# EAGLE design 主機v0.2 (EAGLE 6.3)
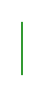
[diagram p0: schematic, sheet 1, part 1 of 2]
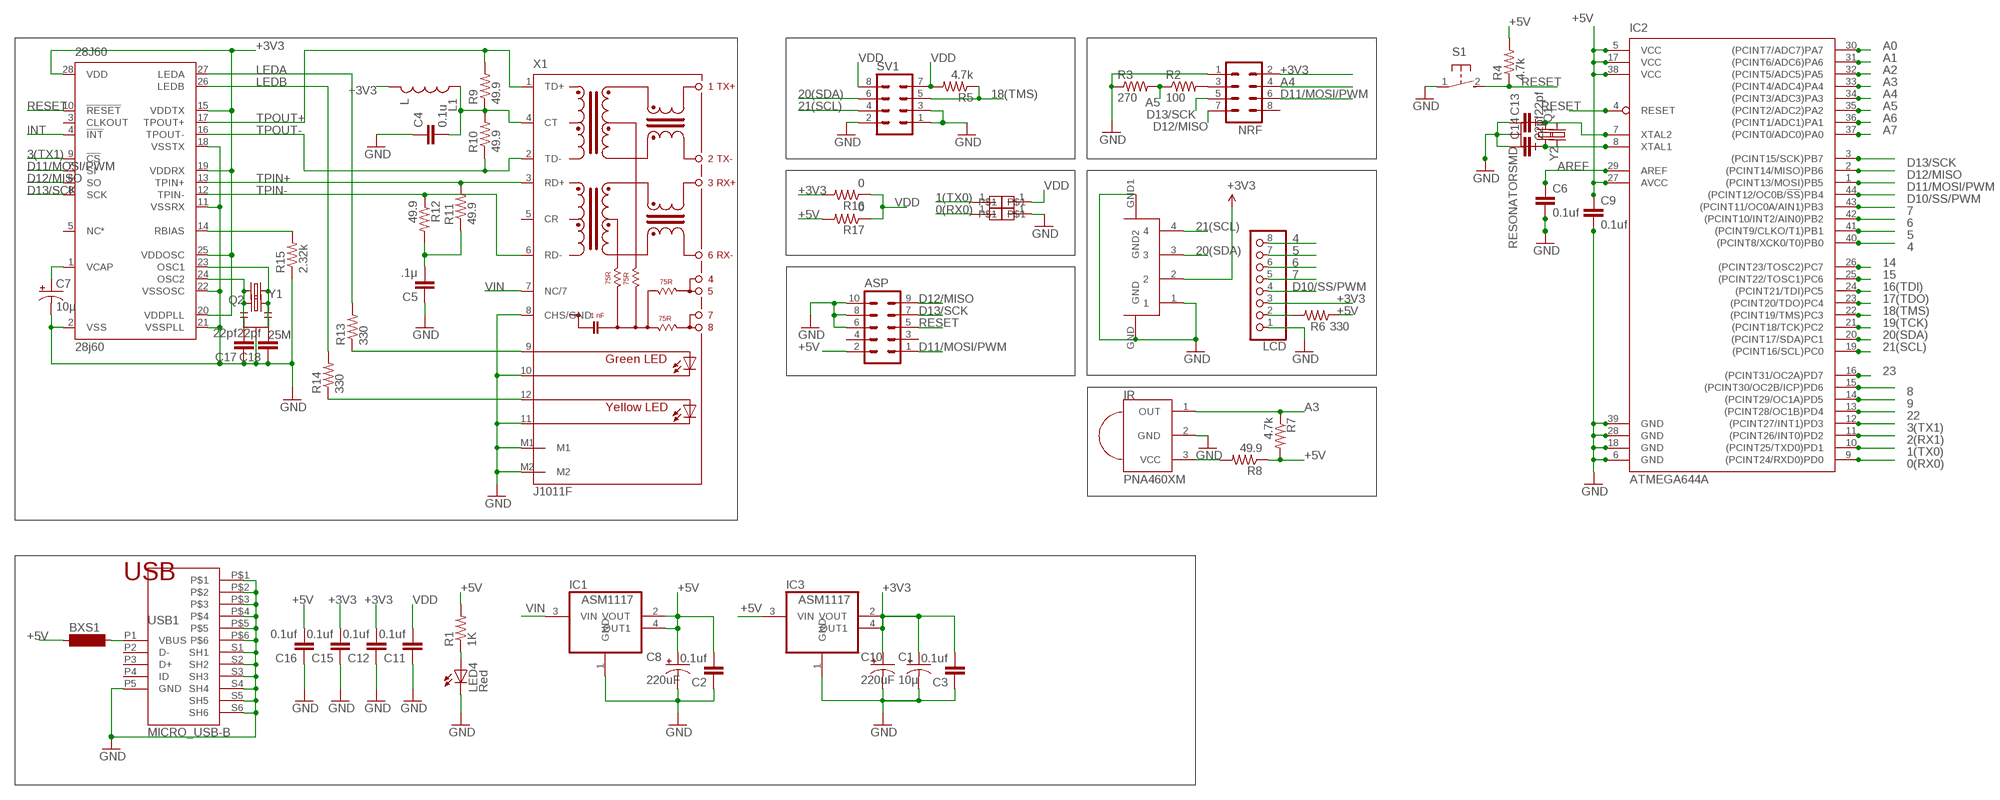
[diagram p1: schematic, sheet 1, part 2 of 2]

## Parts
28J60  28j60  ENC28J60/SS  [SSOP28DB]
ASP  MA05-2  [MA05-2]
BXS1  SM-1206  [SM-1206]
C1  10μ  CAP_POL3528  [EIA3528]
C2  0.1uf  CAP0603-CAP  [0603-CAP]
C3  0.1uf  CAP0603-CAP  [0603-CAP]
C4  0.1u  CAP0603-CAP  [0603-CAP]
C5  .1μ  CAP0603-CAP  [0603-CAP]
C6  0.1uf  CAP0603-CAP  [0603-CAP]
C7  10μ  CAP_POL3528  [EIA3528]
C8  220uF  CPOL-US153CLV-0605  [153CLV-0605]
C9  0.1uf  CAP0603-CAP  [0603-CAP]
C10  220uF  CPOL-US153CLV-0605  [153CLV-0605]
C11  0.1uf  CAP0603-CAP  [0603-CAP]
C12  0.1uf  CAP0603-CAP  [0603-CAP]
C13  22pf  CAP0603-CAP  [0603-CAP]
C14  22pf  CAP0603-CAP  [0603-CAP]
C15  0.1uf  CAP0603-CAP  [0603-CAP]
C16  0.1uf  CAP0603-CAP  [0603-CAP]
C17  22pf  CAP0603-CAP  [0603-CAP]
C18  22pf  CAP0603-CAP  [0603-CAP]
IC1  ASM1117  [SOT223]
IC2  ATMEGA644A  [TQFP44]
IC3  ASM1117  [SOT223]
IR  PNA460XM  [PNA460XM]
L1  L  INDUCTOR0603  [0603]
LCD  PINHD-1X8  [1X08]
LED4  Red  LED0805  [0805-LED]
NRF  MA04-2  [MA04-2]
Q1  CRYSTALHC49S  [HC49/S]
Q2  CRYSTALHC49S  [HC49/S]
R1  1K  RESISTOR0603-RES  [0603-RES]
R2  100  RESISTOR0603-RES  [0603-RES]
R3  270  RESISTOR0603-RES  [0603-RES]
R4  4.7k  RESISTOR0603-RES  [0603-RES]
R5  4.7k  RESISTOR0603-RES  [0603-RES]
R6  330  RESISTOR0603-RES  [0603-RES]
R7  4.7k  RESISTOR0603-RES  [0603-RES]
R8  49.9  RESISTOR0603-RES  [0603-RES]
R9  49.9  RESISTOR0603-RES  [0603-RES]
R10  49.9  RESISTOR0603-RES  [0603-RES]
R11  49.9  RESISTOR0603-RES  [0603-RES]
R12  49.9  RESISTOR0603-RES  [0603-RES]
R13  330  RESISTOR0603-RES  [0603-RES]
R14  330  RESISTOR0603-RES  [0603-RES]
R15  2.32k  RESISTOR0603-RES  [0603-RES]
R16  0  RESISTOR0603-RES  [0603-RES]
R17  0  RESISTOR0603-RES  [0603-RES]
S1  31-XX  [B3F-31XX]
SV1  MA04-2  [MA04-2]
U$2  S4B-XH-SM4-TB  [XH-SM4-TB]
U$4  PIN1  [PIN1]
U$5  PIN1  [PIN1]
U$6  PIN1  [PIN1]
U$7  PIN1  [PIN1]
USB1  MICRO_USB-B  [USB_MICRO_B]
X1  J1011F  RJ45-HR911105A  [HRJ]
Y1  25M  RESONATORSMD  [RESONATOR-SMD]
Y2  RESONATORSMD  [RESONATOR-SMD]

## Nets
0(RX0): IC2.9((PCINT24/RXD0)PD0) U$7.1
1(TX0): IC2.10((PCINT25/TXD0)PD1) U$6.1
2(RX1): IC2.11((PCINT26/INT0)PD2)
3(TX1): 28J60.9(!CS) IC2.12((PCINT27/INT1)PD3)
4: IC2.40((PCINT8/XCK0/T0)PB0) LCD.8
5: IC2.41((PCINT9/CLKO/T1)PB1) LCD.7
6: IC2.42((PCINT10/INT2/AIN0)PB2) LCD.6
7: IC2.43((PCINT11/OC0A/AIN1)PB3) LCD.5
8: IC2.15((PCINT30/OC2B/ICP)PD6)
9: IC2.14((PCINT29/OC1A)PD5)
14: IC2.26((PCINT23/TOSC2)PC7)
15: IC2.25((PCINT22/TOSC1)PC6)
16(TDI): IC2.24((PCINT21/TDI)PC5)
17(TDO): IC2.23((PCINT20/TDO)PC4)
18(TMS): IC2.22((PCINT19/TMS)PC3) R5.1 SV1.5
19(TCK): IC2.21((PCINT18/TCK)PC2)
20(SDA): IC2.20((PCINT17/SDA)PC1) SV1.6 U$2.3
21(SCL): IC2.19((PCINT16/SCL)PC0) SV1.4 U$2.4
22: IC2.13((PCINT28/OC1B)PD4)
23: IC2.16((PCINT31/OC2A)PD7)
+3V3: 28J60.15(VDDTX) 28J60.19(VDDRX) 28J60.20(VDDPLL) 28J60.25(VDDOSC) 28J60.28(VDD) C1.A(+) C3.2 C10.+ C12.2 C15.2 IC3.2(VOUT) IC3.4(OUT1) L1.2 LCD.3 NRF.2 R16.2 U$2.2
+5V: ASP.2 BXS1.1 C2.2 C8.+ C9.1 C16.2 IC1.2(VOUT) IC1.4(OUT1) IC2.5(VCC) IC2.17(VCC) IC2.27(AVCC) IC2.38(VCC) IC3.3(VIN) R1.2 R4.2 R6.1 R7.2 R8.1 R17.2
A0: IC2.30((PCINT7/ADC7)PA7)
A1: IC2.31((PCINT6/ADC6)PA6)
A2: IC2.32((PCINT5/ADC5)PA5)
A3: IC2.33((PCINT4/ADC4)PA4) IR.1(OUT) R7.1
A4: IC2.34((PCINT3/ADC3)PA3) NRF.4
A5: IC2.35((PCINT2/ADC2)PA2) R2.1 R3.2
A6: IC2.36((PCINT1/ADC1)PA1)
A7: IC2.37((PCINT0/ADC0)PA0)
AREF: C6.1 IC2.29(AREF)
D10/SS/PWM: IC2.44((PCINT12/OC0B/!SS!)PB4) LCD.4
D11/MOSI/PWM: 28J60.7(SI) ASP.1 IC2.1((PCINT13/MOSI)PB5) NRF.6
D12/MISO: 28J60.6(SO) ASP.9 IC2.2((PCINT14/MISO)PB6) NRF.7
D13/SCK: 28J60.8(SCK) ASP.7 IC2.3((PCINT15/SCK)PB7) NRF.5
GND [power]: 28J60.2(VSS) 28J60.11(VSSRX) 28J60.18(VSSTX) 28J60.21(VSSPLL) 28J60.22(VSSOSC) ASP.6 ASP.8 ASP.10 C1.C(-) C2.1 C3.1 C4.1 C5.1 C6.2 C7.C(-) C8.- C9.2 C10.- C11.1 C12.1 C13.1 C14.1 C15.1 C16.1 C17.1 C18.1 IC1.1(GND) IC2.6(GND) IC2.18(GND) IC2.28(GND) IC2.39(GND) IC3.1(GND) IR.2(GND) LCD.1 LED4.C NRF.1 R3.1 R15.1 S1.1(P) SV1.1 SV1.2 SV1.3 U$2.1 U$2.GND U$2.GND1(GND2) U$4.1 USB1.P5(GND) USB1.P$1 USB1.P$2 USB1.P$3 USB1.P$4 USB1.P$5 USB1.P$6 USB1.S1(SH1) USB1.S2(SH2) USB1.S3(SH3) USB1.S4(SH4) USB1.S5(SH5) USB1.S6(SH6) X1.8(CHS/GND) X1.10(C-R) X1.11(C-L) X1.M1 X1.M2 Y1.2 Y2.2
INT: 28J60.4(!INT)
LEDA: 28J60.27(LEDA) R13.2
LEDB: 28J60.26(LEDB) R14.2
N$1: C13.2 IC2.7(XTAL2) Q1.2 Y2.1
N$3: IR.3(VCC) R8.2
N$5: LED4.A R1.1
N$7: NRF.3 R2.2
N$9: C5.2 R11.1 R12.2
N$11: 28J60.1(VCAP) C7.A(+)
N$13: 28J60.14(RBIAS) R15.2
N$14: C14.2 IC2.8(XTAL1) Q1.1 Y2.3
N$15: C4.2 L1.1 R9.1 R10.2 X1.4(CT)
N$16: 28J60.24(OSC2) C17.2 Q2.2 Y1.1
N$17: 28J60.23(OSC1) C18.2 Q2.1 Y1.3
N$23: R13.1 X1.9(A-R)
N$24: R14.1 X1.12(AL)
N$29: LCD.2 R6.2
RESET: 28J60.10(!RESET) ASP.5 IC2.4(RESET) R4.1 S1.2(S)
TPIN+: 28J60.13(TPIN+) R11.2 X1.3(RD+)
TPIN-: 28J60.12(TPIN-) R12.1 X1.6(RD-)
TPOUT+: 28J60.17(TPOUT+) R9.2 X1.1(TD+)
TPOUT-: 28J60.16(TPOUT-) R10.1 X1.2(TD-)
VDD: C11.2 R5.2 R16.1 R17.1 SV1.7 SV1.8 U$5.1
VIN: IC1.3(VIN) X1.7(NC/7)
VUSB: BXS1.2 USB1.P1(VBUS)
Unconnected: 28J60.3(CLKOUT) 28J60.5(NC*) ASP.3 ASP.4 NRF.8 USB1.P2(D-) USB1.P3(D+) USB1.P4(ID) X1.5(CR)

## Notes on the sheet
- USB

## Library data of the parts
28J60 = MY3:ENC28J60: Stand-Alone Ethernet Controller with SPI Interface Source: http://ww1.microchip.com/downloads/en/DeviceDoc/39662c.pdf
ASP = pkj:MA05-2: PIN HEADER; OC_FARNELL: unknown; OC_NEWARK: unknown
BXS1 = inductor-neosid:SM-1206: INDUCTOR SMD chip inductor; OC_FARNELL: unknown; OC_NEWARK: unknown
C1 C7 = 00my:CAP_POL: Capacitor Polarized These are standard SMD and PTH capacitors. Normally 10uF, 47uF, and 100uF in electrolytic and tantalum varieties. Always verify the external diameter of the through hole cap, it varies with capacity, voltage, and manufacturer. The EIA devices should be standard.
C2 C3 C11 C12 C15 C16 = MY:CAP: Capacitor Standard 0603 ceramic capacitor, and 0.1" leaded capacitor.
C4-C6 C9 C13 C14 C17 C18 = 00my:CAP: Capacitor Standard 0603 ceramic capacitor, and 0.1" leaded capacitor.
C8 C10 = resistor:CPOL-US: POLARIZED CAPACITOR, American symbol
IC1 IC3 = MY3:ASM1117: 800mA and 1A Low Dropout (LDO) Positive Regulator 1.8V, 2.5V, 2.85V, 3.3V, 5V, and Adj; MPN: REG1117; OC_FARNELL: 1097566; OC_NEWARK: 14P6981
IC2 = 00my:ATMEGA644: 8-bit Microcontroller with 64K Bytes In-System Programmable Flash Source: http://www.atmel.com/dyn/resources/prod_documents/doc2593.pdf; MPN: ATMEGA644PV-10AU; OC_FARNELL: 1455123; OC_NEWARK: 58M3748
IR = adafruit:PNA460XM: IR 38KHz receiver PNA4602 and related receivers http://www.ladyada.net/library/pcb/eaglelibrary.html
L1 = 00my:INDUCTOR: Inductors Basic Inductor/Choke - 0603 and 1206. Footprints are not proven and vary greatly between part numbers.
LCD = pinhead:PINHD-1X8: PIN HEADER
LED4 = MY:LED: LEDs Standard schematic elements and footprints for 5mm, 3mm, 1206, and 0603 sized LEDs. 5mm - Spark Fun Electronics SKU : COM-00529 (and others)
NRF SV1 = pkj:MA04-2: PIN HEADER; OC_FARNELL: unknown; OC_NEWARK: unknown
Q1 Q2 = crystal:CRYSTAL: CRYSTAL; OC_FARNELL: 1667008; OC_NEWARK: unknown
R1-R3 R5-R8 R16 R17 = MY:RESISTOR: Resistor Basic schematic elements and footprints for 0603, 1206, and PTH 1/10th watt (small) resistors.
R4 R9-R15 = 00my:RESISTOR: Resistor Basic schematic elements and footprints for 0603, 1206, and PTH 1/10th watt (small) resistors.
S1 = switch-omron:31-XX: OMRON SWITCH; MPN: B3F-3100; OC_FARNELL: 959704; OC_NEWARK: 36M3582
U$2 = microduino:S4B-XH
U$4-U$7 = pkj:PIN1
USB1 = 00my:MICRO_USB
X1 = 00my:RJ45: PULSEJACK (TM) 1x1 Tab-UP RJ45 10/100 Base-TX RJ45 1x1 Tab-UP with LEDs 8-pin (J1 series) and 6-pin (JP series) integrated magnetics connector, designed to support applications, such as ADSL modems, LAN-on-Motherboard, and Hub and Switches. Source: www.pulseeng.com .. PulseJack-J402.pdf
Y1 = 00my:RESONATOR: Resonator Small SMD resonator. This is the itty bitty 10/20MHz resonators with built in caps. CSTCE10M0G55 and CSTCE20M0V53. Footprint has been reviewed closely but hasn't been tested yet.
Y2 = MY:RESONATOR: Resonator Small SMD resonator. This is the itty bitty 10/20MHz resonators with built in caps. CSTCE10M0G55 and CSTCE20M0V53. Footprint has been reviewed closely but hasn't been tested yet.

## Net classes
1 power: width 0.381 mm

## Board
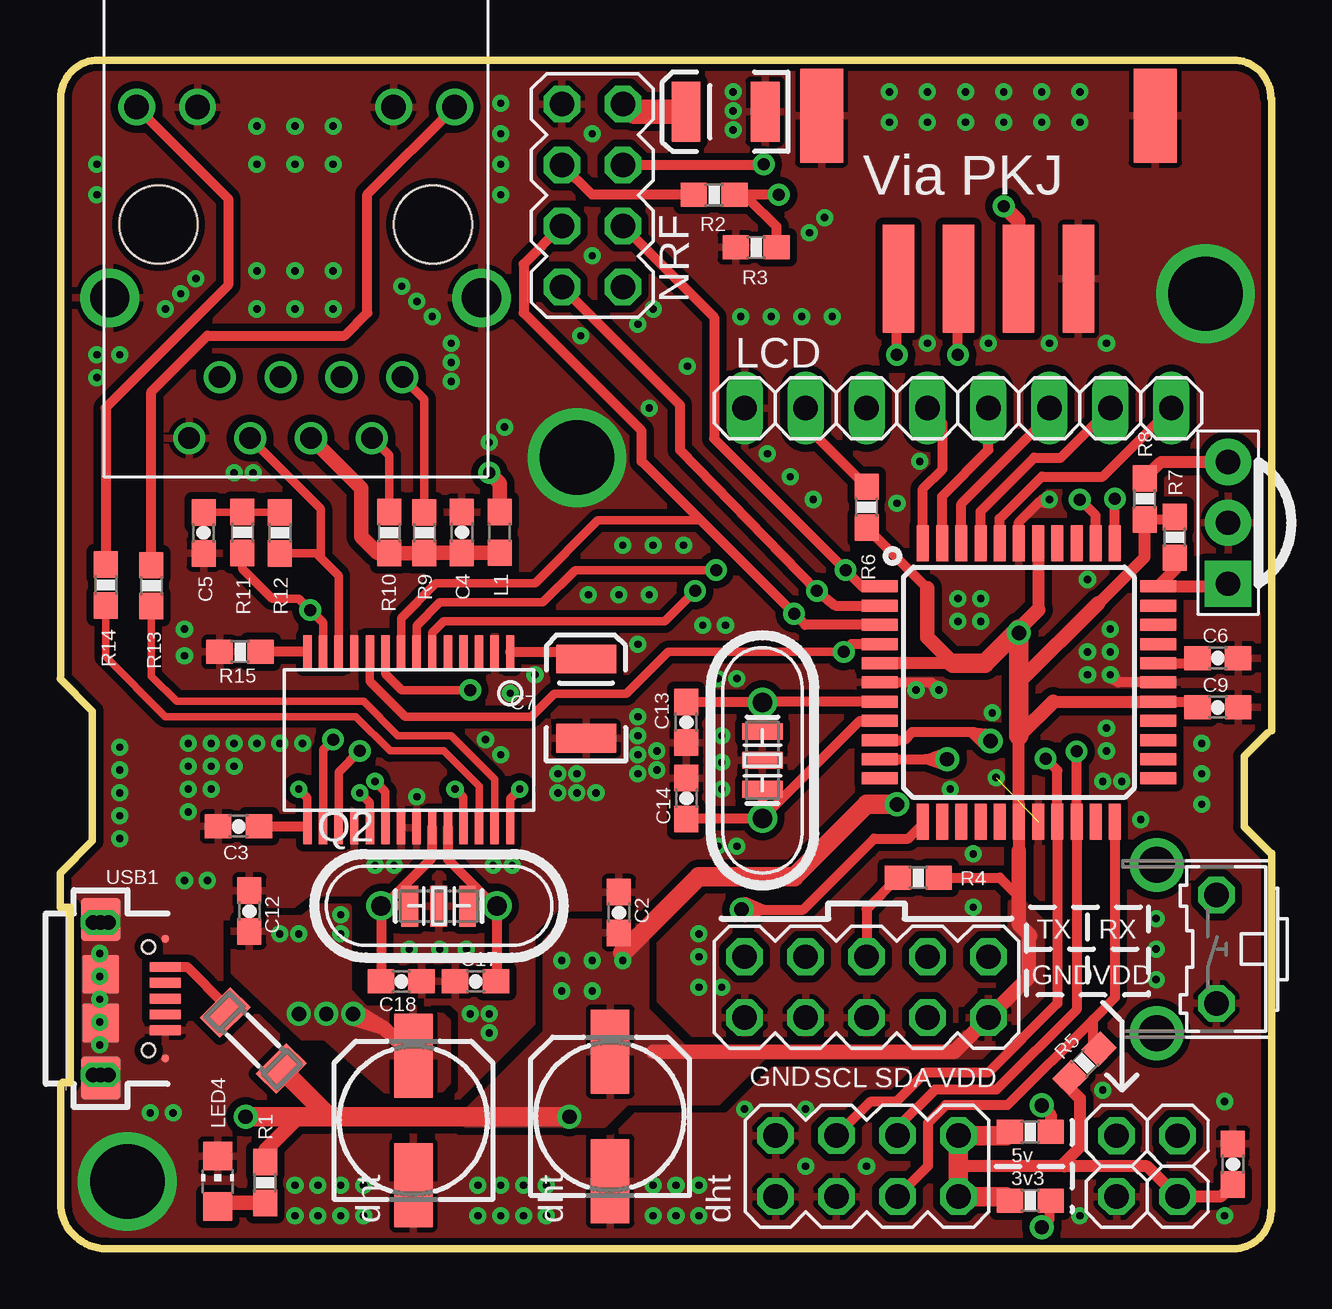
[diagram p2: board, top side]
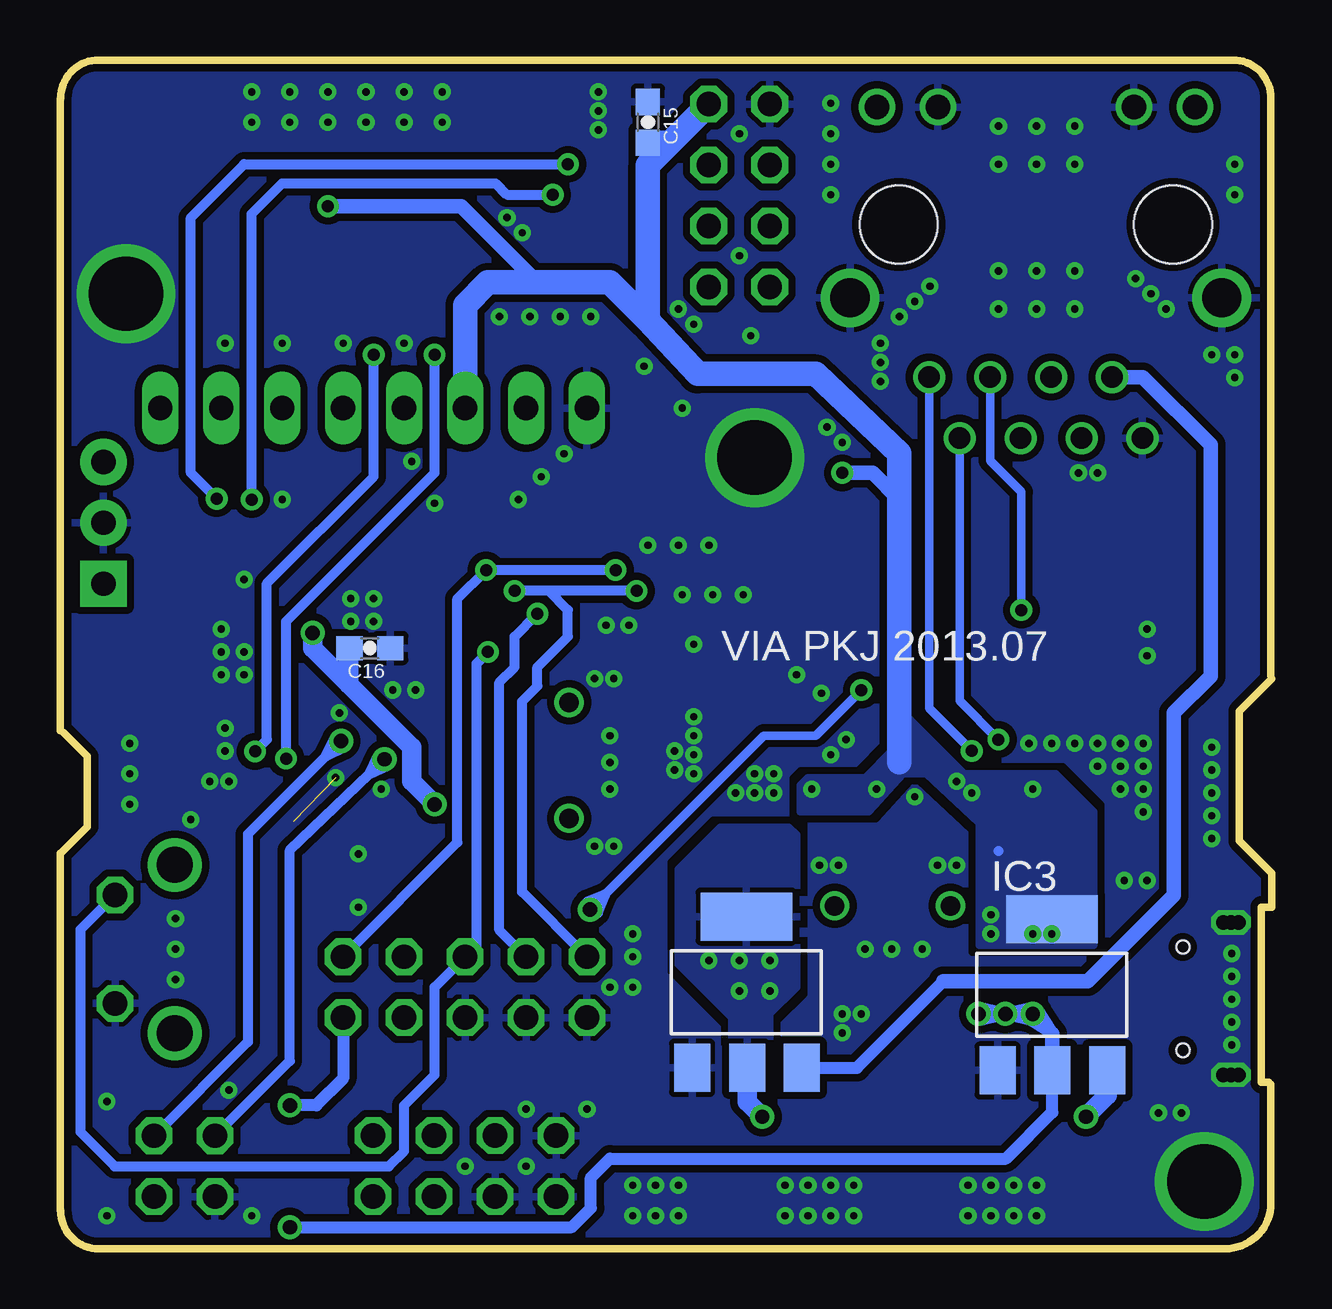
[diagram p3: board, bottom side, seen from below]

Size 50.48 x 49.53 mm. Coordinates in mm from the lower left corner, seen from the top.
Outline: 50.46,1.59 arc-90 48.87,0 1.93,0 arc-90 0.03,1.91 0.03,6.85
Outline: 50.46,47.94 arc90 48.87,49.53 1.61,49.53 arc90 0.03,47.94
Outline: 0.03,47.83 0.03,23.88
Outline: 0,23.75 1.35,22.4 1.35,16.99 0,15.65 0,14.23 0.43,14.23 0.43,6.93 0.11,6.93
Outline: 50.32,21.49 49.34,20.51 49.34,17.59 50.44,16.49
Outline: 50.48,16.49 50.48,1.58
Outline: 50.48,47.92 50.48,21.58
Copper layers (1*16): Top 0.035mm / dielectric 1.5mm / Bottom 0.035mm
Design rules "pkj2 *": minimum track width 8mil, minimum drill 2mil, track to track 8mil, track to pad 8mil, pad to pad 8mil, via to via 8mil, smd to smd 0mil, copper to edge 8mil, drill to drill 8mil, minimum pad ring 8mil, minimum via ring 8mil, stop-mask expansion 2mil, vias tented up to drill 25mil, thermal gap 8mil

### Footprints (pad centres in the part's own frame; a part is rotated, then mirrored left to right if it is on the bottom)
SSOP28DB = smd 0.348 x 1.397: 1 -4.225,-3.656; 2 -3.575,-3.656; 3 -2.925,-3.656; 4 -2.275,-3.656; 5 -1.625,-3.656; 6 -0.975,-3.656; 7 -0.325,-3.656; 8 0.325,-3.656; 9 0.975,-3.656; 10 1.625,-3.656; 11 2.275,-3.656; 12 2.925,-3.656; 13 3.575,-3.656; 14 4.225,-3.656; 15 4.225,3.656; 16 3.575,3.656; 17 2.925,3.656; 18 2.275,3.656; 19 1.625,3.656; 20 0.975,3.656; 21 0.325,3.656; 22 -0.325,3.656; 23 -0.975,3.656; 24 -1.625,3.656; 25 -2.275,3.656; 26 -2.925,3.656; 27 -3.575,3.656; 28 -4.225,3.656
MA05-2 = drill 1.016 octagon: 1 -5.08,-1.27; 2 -5.08,1.27; 3 -2.54,-1.27; 4 -2.54,1.27; 5 0,-1.27; 6 0,1.27; 7 2.54,-1.27; 8 2.54,1.27; 9 5.08,-1.27; 10 5.08,1.27
SM-1206 = smd 1.2 x 1.8: 1 -1.65,0; 2 1.65,0
EIA3528 = smd 1.2 x 2.5: A 1.65,0; C -1.65,0
0603-CAP = smd 1.1 x 1: 1 -0.85,0; 2 0.85,0
153CLV-0605 = smd 3.5 x 1.6: + 2.7,0; - -2.7,0
SOT223 = smd 1.499 x 2.007: 1 -2.261,-3.15; 2 0.025,-3.15; 3 2.311,-3.15 | smd 3.81 x 2.007: 4 0,3.15
TQFP44 = smd 1.5 x 0.5: 1 -5.8,4; 2 -5.8,3.2; 3 -5.8,2.4; 4 -5.8,1.6; 5 -5.8,0.8; 6 -5.8,0; 7 -5.8,-0.8; 8 -5.8,-1.6; 9 -5.8,-2.4; 10 -5.8,-3.2; 11 -5.8,-4; 23 5.8,-4; 24 5.8,-3.2; 25 5.8,-2.4; 26 5.8,-1.6; 27 5.8,-0.8; 28 5.8,0; 29 5.8,0.8; 30 5.8,1.6; 31 5.8,2.4; 32 5.8,3.2; 33 5.8,4 | smd 0.5 x 1.5: 12 -4,-5.8; 13 -3.2,-5.8; 14 -2.4,-5.8; 15 -1.6,-5.8; 16 -0.8,-5.8; 17 0,-5.8; 18 0.8,-5.8; 19 1.6,-5.8; 20 2.4,-5.8; 21 3.2,-5.8; 22 4,-5.8; 34 4,5.8; 35 3.2,5.8; 36 2.4,5.8; 37 1.6,5.8; 38 0.8,5.8; 39 0,5.8; 40 -0.8,5.8; 41 -1.6,5.8; 42 -2.4,5.8; 43 -3.2,5.8; 44 -4,5.8
PNA460XM = drill 1.016 pad 1.93 square: 1 -2.54,0 | drill 1.016 pad 1.93: 2 0,0; 3 2.54,0
0603 = smd 1.1 x 1: 1 -0.85,0; 2 0.85,0
1X08 = drill 1.016 long: 1 -8.89,0; 2 -6.35,0; 3 -3.81,0; 4 -1.27,0; 5 1.27,0; 6 3.81,0; 7 6.35,0; 8 8.89,0
0805-LED = smd 1.2 x 1.2: A 0,-1.05; C 0,1.05
MA04-2 = drill 1.016 octagon: 1 -3.81,-1.27; 2 -3.81,1.27; 3 -1.27,-1.27; 4 -1.27,1.27; 5 1.27,-1.27; 6 1.27,1.27; 7 3.81,-1.27; 8 3.81,1.27
HC49/S = drill 0.813: 1 -2.413,0; 2 2.413,0
0603-RES = smd 1.1 x 1: 1 -0.85,0; 2 0.85,0
B3F-31XX = drill 1.016 octagon: 1 -2.261,-1.245; 2 2.261,-1.245 | drill 1.499 pad 2.159: 3 -3.505,1.245; 4 3.505,1.245
XH-SM4-TB = smd 1.3 x 4.5: 1 -3.75,8.75; 2 -1.25,8.75; 3 1.25,8.75; 4 3.75,8.75 | smd 1.8 x 3.9: GND -6.95,1.95; GND1 6.95,1.95
PIN1 = drill 1.016 octagon: 1 0,0
USB_MICRO_B = smd 0.406 x 1.346: P1 -1.321,2.692; P2 -0.66,2.692; P3 0,2.692; P4 0.66,2.692; P5 1.321,2.692 | drill 0.6 octagon: P$1 -3.175,0.318; P$2 -3.175,0; P$3 -3.175,-0.318; P$4 3.175,0.318; P$5 3.175,0; P$6 3.175,-0.318 | smd 1.778 x 1.651: S1 -3.302,0; S2 3.302,0 | smd 0.305 x 0.305: S3 -2.489,2.692; S4 2.489,2.692 | smd 1.626 x 1.524: S5 -1.016,0; S6 1.016,0 | hole 0.55: -2.15,2; 2.15,2
HRJ = drill 0.89: 1 4.45,-6.35; 2 3.18,-8.89; 3 1.91,-6.35; 4 0.64,-8.89; 5 -0.63,-6.35; 6 -1.9,-8.89; 7 -3.17,-6.35; 8 -4.44,-8.89 | drill 1.02: 9 6.625,4.9; 10 4.085,4.9; 11 -4.085,4.9; 12 -6.625,4.9 | drill 1.63: M1 -7.745,-3.05; M2 7.745,-3.05 | hole 3.25: -5.715,0; 5.715,0
RESONATOR-SMD = smd 0.7 x 1.7: 1 -1.2,0; 2 0,0; 3 1.2,0

### Placement (x,y rotation side)
28J60  14.53,21.2 180 top
ASP  33.6,10.9 180 top
BXS1  8.05,8.67 135 top
C1  27.73,47.38 180 top
C2  23.29,14.01 270 top
C3  7.44,17.6 0 top
C4  16.75,29.84 270 top
C5  5.98,29.82 90 top
C6  48.24,24.61 0 top
C7  21.92,22.92 90 top
C8  22.92,5.52 90 top
C9  48.24,22.56 0 top
C10  14.73,5.35 90 top
C11  48.87,3.52 270 top
C12  7.89,14.07 270 top
C13  26.1,21.94 90 top
C14  26.1,18.76 270 top
C15  25.98,46.93 270 bottom
C16  37.57,25.03 180 bottom
C17  17.32,11.14 0 top
C18  14.22,11.14 180 top
IC1  21.88,10.69 0 bottom
IC2  39.95,23.6 0 top
IC3  9.16,10.58 0 bottom
IR  48.67,30.25 90 top
L1  18.32,29.85 90 top
LCD  37.41,35.03 0 top
LED4  6.57,2.81 0 top
NRF  22.18,43.89 270 top
Q1  29.27,20.35 90 top
Q2  15.79,14.29 0 top
R1  8.55,2.76 90 top
R2  27.25,43.92 180 top
R3  29.01,41.72 0 top
R4  35.77,15.46 0 top
R5  42.7,7.73 225 top
R6  33.6,30.9 90 top
R7  46.46,29.64 90 top
R8  45.19,31.24 90 top
R9  15.19,29.83 90 top
R10  13.72,29.84 270 top
R11  7.6,29.84 270 top
R12  9.16,29.82 90 top
R13  3.81,27.63 270 top
R14  1.9,27.65 270 top
R15  7.5,24.87 0 top
R16  40.43,2.01 0 top
R17  40.43,4.86 0 top
S1  46.94,12.48 90 top
SV1  33.62,3.44 0 top
U$2  38.68,49.16 180 top
U$4  44.02,2.17 0 top
U$5  46.56,2.17 0 top
U$6  44.02,4.71 0 top
U$7  46.56,4.71 0 top
USB1  1.7,10.42 270 top
X1  9.82,42.67 0 top
Y1  15.78,14.27 180 top
Y2  29.27,20.35 270 top

### Tracks (layer width: path | path; a pad name or v marks a point on that pad's centre or on a via)
0(RX0)  (via drill 0.6)
  Top 0.406: IC2.9 35.17,21.2 35.51,21.53 37.95,21.53 | 37.95,21.53 38.07,21.53 v38.77,21.16 | 37.95,21.53 38.56,20.94 v38.77,21.16 | 37.95,21.53 38.8,21.45 v38.77,21.16
  Bottom 0.406: v38.77,21.16 39.41,20.52 | 39.41,20.52 42.65,17.27 42.65,8.62 U$7.1 | 39.41,20.52 39.04,21.28 v38.77,21.16 | 39.41,20.52 38.64,20.88 v38.77,21.16
1(TX0)  (via drill 0.6)
  Top 0.406: IC2.10 36.06,20.4 | 36.06,20.4 v36.96,20.4 | 36.06,20.4 36.86,20.68 | 36.86,20.11 36.06,20.4 36.86,20.68 | 36.86,20.11 | v36.96,20.4 36.86,20.11 | v36.96,20.4 36.86,20.68 | 36.06,20.4 36.86,20.11 | v36.96,20.4 36.86,20.11 | 36.06,20.4 36.86,20.68 | v36.96,20.4 36.86,20.68
  Bottom 0.406: 37.6,19.76 40.91,16.61 40.91,7.83 U$6.1 | 37.6,19.76 v36.96,20.4 | 37.6,19.76 37.23,20.53 v36.96,20.4 | 37.6,19.76 36.83,20.13 v36.96,20.4
3(TX1)  (via drill 0.5, 0.6)
  Top 0.356: 28J60.9 13.56,23.96 14.24,23.28 v17.09,23.28
  Top 0.406: v28.4,14.13 29.3,14.13 | 29.3,14.13 28.54,14.45 v28.4,14.13 | 29.3,14.13 28.54,13.81 v28.4,14.13 | 29.3,14.13 | 29.3,14.13 30.96,14.13 33.92,17.09 35.35,17.09 35.95,17.69 IC2.12 | 29.3,14.13 28.5,14.41 | 28.5,14.41 | v28.4,14.13 28.5,14.41 | 29.3,14.13 28.5,13.85 | 28.5,13.85 | 29.3,14.13 28.5,14.41 | 28.5,14.41 | 29.3,14.13 28.5,14.41 | v28.4,14.13 28.5,14.41 | 29.3,14.13 | 29.3,14.13 28.5,13.85 | 28.5,13.85 | v28.4,14.13 28.5,13.85 | 29.3,14.13 28.5,14.41 | 29.3,14.13 28.5,13.85 | v28.4,14.13 28.5,13.85 | 29.3,14.13 28.5,14.41 | v28.4,14.13 28.5,14.41 | 29.3,14.13 28.5,13.85 | v28.4,14.13 28.5,13.85
  Bottom 0.356: v17.09,23.28 19,21.37 21.16,21.37 27.76,14.77
  Bottom 0.406: 27.76,14.77 v28.4,14.13 | 27.76,14.77 28.08,14 v28.4,14.13 | 27.76,14.77 28.53,14.45 v28.4,14.13 | 27.76,14.77 28.13,14 v28.4,14.13 | 27.76,14.77 28.53,14.4 v28.4,14.13
4
  Top 0.406: IC2.40 39.15,30.42 40.91,32.17 43.45,32.17 LCD.8
5
  Top 0.406: IC2.41 38.35,30.73 40.59,32.96 41.7,32.96 LCD.7
6
  Top 0.406: IC2.42 37.55,31.04 41.22,34.71 LCD.6
7
  Top 0.406: IC2.43 36.75,31.35 38.68,33.28 LCD.5
18(TMS)
  Top 0.406: SV1.5 36.16,3.44 36.16,5.23 36.91,5.98 39.48,5.98 43.05,9.55 | R5.1 43.05,8.58 43.05,9.55 | IC2.22 43.95,10.46 43.05,9.55
20(SDA)  (via drill 0.5)
  Top 0.406: SV1.6 34.89,5.06 36.46,6.63 39.02,6.63 42.35,9.96 IC2.20 v42.35,20.72 | v37.41,37.25 37.41,39.43 U$2.3
  Bottom 0.406: v42.35,20.72 41.86,21.22 41.86,27.72 37.41,32.17 v37.41,37.25
21(SCL)  (via drill 0.5)
  Top 0.406: SV1.4 33.76,6.12 34.84,6.12 36.06,7.34 38.67,7.34 41.55,10.22 IC2.19 41.55,19.93 v41.07,20.42 | v34.87,37.25 34.87,40.35 U$2.4
  Bottom 0.406: v41.07,20.42 41.07,26.14 34.87,32.33 v34.87,37.25
+3V3  (via drill 0.3, 0.5, 0.6)
  Top 0.305: 10.25,17.6 28J60.15
  Top 0.356: 28J60.25 16.81,18.8 v16.46,19.15 | 28J60.15 10.31,18.79 v9.95,19.15 | 28J60.20 13.56,19.04 v13.13,19.47 | 28J60.19 12.91,18.57 v12.49,18.99 | 28J60.28 18.76,18.75 v19.16,19.15
  Top 0.406: R16.2 41.22,1.95 41.22,1.21 v40.91,0.9 | C3.2 10.25,17.6
  Top 0.61: C10.+ 13.5,9.18 | 13.5,9.18 v12.21,9.79 12.12,9.61 13.5,9.18 | 13.5,9.18 12.37,9.9 | L1.2 18.32,31.9 v17.89,32.33 | U$2.2 39.93,42.83 v39.32,43.44
  Top 1.016: C1.A 23.93,47.38 NRF.2
  Bottom 0.406: 11.38,16.58 11.39,16.58
  Bottom 0.508: v40.91,0.9 29.16,0.9 28.37,1.69 28.37,2.96 27.57,3.75 11.06,3.75 9.13,5.68 IC3.2
  Bottom 0.61: v12.21,9.79 11.31,9.79 | 11.31,9.79 10.85,9.79 | 10.85,9.79 v9.95,9.79 | v9.95,9.79 9.31,9.15 | 9.31,9.15 9.13,8.97 IC3.2 | 12.17,9.59 | 12.17,9.98 | 10.85,9.79 9.99,9.98 | v9.95,9.79 9.99,9.98 | 10.85,9.79 9.99,9.59 | v9.95,9.79 9.99,9.59 | 9.31,9.15 10.06,9.62 | v9.95,9.79 10.06,9.62 | 9.31,9.15 9.78,9.89 | v9.95,9.79 9.78,9.89 | 11.31,9.79 12.17,9.59 | v12.21,9.79 12.17,9.59 | 11.31,9.79 12.17,9.98 | v12.21,9.79 12.17,9.98 | 11.31,9.79 12.17,9.59 | 11.31,9.79 12.17,9.98 | 11.31,9.79 12.17,9.59 | v12.21,9.79 12.17,9.59 | 11.31,9.79 12.17,9.98 | v12.21,9.79 12.17,9.98 | 10.85,9.79 9.99,9.98 | v9.95,9.79 9.99,9.98 | 10.85,9.79 9.99,9.59 | v9.95,9.79 9.99,9.59 | 10.85,9.79 9.99,9.98 | 10.85,9.79 9.99,9.59 | 10.85,9.79 9.99,9.98 | v9.95,9.79 9.99,9.98 | 10.85,9.79 9.99,9.59 | v9.95,9.79 9.99,9.59 | 9.31,9.15 10.06,9.62 | v9.95,9.79 10.06,9.62 | 9.31,9.15 9.78,9.89 | v9.95,9.79 9.78,9.89 | 23.48,47.73 NRF.2 | v17.89,32.33 16.63,32.33 15.52,31.22 | v39.32,43.44 33.76,43.44 30.59,40.27
  Bottom 1.016: 25.99,38.68 25.99,45.16 25.06,46.08 | 25.06,46.08 NRF.2 | 15.52,20.27 15.52,31.22 15.52,33.14 18.98,36.45 23.92,36.45 25.99,38.68 | LCD.3 33.6,39.31 32.65,40.27 30.59,40.27 27.58,40.27 25.99,38.68 | C15.2 25.06,46.08
  other vias: 11.7,13.12 11.7,13.91 9.16,13.12 9.95,13.12 11.09,9.79
  pour Bottom (rank 5, no thermals): 12.17,12.64 12.17,17.72 14.4,19.79 15.35,19.79 16.78,18.2 19.63,18.2 19.63,19.31 19.32,19.63 16.94,19.63 15.82,20.74 15.82,22.17 15.19,22.17 12.81,19.79 9,19.79 7.41,18.2 7.41,12.64
  pour Top (isolate 0.305, rank 5): 7.25,13.75 10.11,13.75 10.74,14.23 12.01,14.23 12.01,10.74 12.72,9.98 15.58,9.98 16.14,9.47 16.14,6.93 15.82,6.61 13.6,6.61 11.06,8.83 10.11,8.83 7.25,11.53
+5V  (via drill 0.3, 0.6)
  Top 0.406: IC2.27 47.16,22.8 C9.1 | 43.28,26.9 43.26,26.9 | R8.1 46.36,30.39 R7.2 | R4.2 39.16,15.46 39.95,14.67 | 36.13,27.52 R6.1
  Top 0.508: 39.95,21.37 IC2.17 39.95,16.58 | 41.38,22.8 IC2.27 | IC2.38 40.75,26.62 | 37.21,24.4 IC2.5 | 43.28,26.9 45.19,28.82 R8.1 | v40.91,5.98 41.28,5.6 R17.2
  Top 0.61: 40.75,26.62 39.95,25.82 | 41.38,22.8 39.95,21.37 | 24.71,8.21 37.27,8.21 ASP.2 40.37,11.31 40.37,13.07 | 36.13,27.52 36.13,25.49 37.21,24.4 | 43.26,26.9 39.95,23.6 | R1.2 8.55,4.1 9.95,5.5 | 22.76,8.21 C8.+ | 23.44,12.33 v23.44,12.01 | 39.95,16.58 39.95,14.67 39.95,13.52 40.43,13.04
  Top 0.813: 37.21,24.4 38.53,24.4 39.95,25.82 v39.95,25.66 39.95,23.6 39.95,21.37 | v21.22,5.5 11.22,5.5 | 11.22,5.5 9.63,7.09 BXS1.1 | v7.73,5.5 9.95,5.5 11.22,5.5 | v34.87,18.52 33.6,18.52 30.59,15.5 26.62,15.5 23.44,12.33
  Bottom 0.508: ASP.2 38.69,7.08 39.8,5.98 v40.91,5.98
  Bottom 0.61: ASP.2
  Bottom 0.813: IC1.2 21.85,6.13 v21.22,5.5 | IC3.3 6.85,6.39 v7.73,5.5 | v34.87,18.52 35.83,19.47 35.83,20.9 38.45,23.52 | 38.45,23.52 39.95,25.03 v39.95,25.66 | C16.2 38.45,25 38.45,23.52
  other vias: 20.9,12.01 22.17,12.01 20.9,10.74 22.17,10.74
  pour Top (isolate 0.305, rank 5): 16.94,5.18 22.65,5.18 23.6,6.13 27.41,6.13 29.32,8.04 38.37,8.04 40.91,10.58 40.91,13.6 40.11,14.39 39.64,14.39 39.64,13.44 40.11,12.96 40.11,11.21 39.32,10.42 38.37,10.42 37.89,9.94 37.89,9.15 37.1,8.36 25.98,8.36 24.4,9.94 24.4,13.12 23.92,13.6 21.06,13.6 20.27,12.8 20.27,8.99 16.94,5.66
  pour Bottom (isolate 0.305, rank 5): 19.79,10.9 20.9,9.79 20.9,8.2 21.22,7.88 22.33,7.88 22.49,8.04 22.49,9.63 24.71,11.85 24.71,15.82 22.97,17.56 20.11,17.56 19.79,17.25
A3
  Top 0.406: 48.41,27.6 IR.1
  Top 0.508: 48.41,27.6 IC2.33 46.46,28.3 R7.1
A4  (via drill 0.5)
  Top 0.406: IC2.34 v43.95,31.25 | v29.32,45.19 29.29,45.16 NRF.4
  Bottom 0.406: v43.95,31.25 45.03,32.33 45.03,42.96 42.81,45.19 v29.32,45.19
A5  (via drill 0.5)
  Top 0.406: IC2.35 43.15,30.56 v42.49,31.22 | v29.95,43.92 28.68,43.92 | 28.68,43.92 R2.1 | R3.2 29.86,42.58 28.68,43.76 28.68,43.92
  Bottom 0.406: v42.49,31.22 42.49,43.12 41.22,44.39 32.33,44.39 31.86,43.92 v29.95,43.92
AREF
  Top 0.406: IC2.29 47.18,24.4 C6.1
D10/SS/PWM
  Top 0.406: IC2.44 35.95,31.66 36.78,32.49 36.78,34.39 LCD.4
D11/MOSI/PWM  (via drill 0.5)
  Top 0.356: 28J60.7 14.86,25.97 15.82,26.93 20.11,26.93 21.46,28.28 v27.33,28.28
  Top 0.406: NRF.6 27.25,38.81 27.25,33.76 v32.73,28.28 33.41,27.6 IC2.1
  Bottom 0.406: ASP.1 33.92,16.93 33.92,27.09 v32.73,28.28 v27.33,28.28
D12/MISO  (via drill 0.5)
  Top 0.356: 28J60.6 15.51,25.66 15.98,26.14 25.19,26.14 v26.46,27.41
  Top 0.406: IC2.2 32.31,26.8 v31.54,27.41 25.83,33.28 25.83,35.16 NRF.7
  Bottom 0.406: v26.46,27.41 30.11,27.41 | 30.11,27.41 v31.54,27.41 | ASP.9 31.22,14.87 31.22,22.8 30.59,23.44 30.59,24.23 29.32,25.5 29.32,26.61 30.11,27.41
D13/SCK  (via drill 0.5)
  Top 0.356: 28J60.8 14.21,26.27 15.67,27.72 19.79,27.72 22.41,30.34 26.7,30.34
  Top 0.406: NRF.5 19.32,41.02 19.32,39 24.24,34.07 24.24,32.8 26.7,30.34 v30.59,26.45 31.05,26 IC2.3
  Bottom 0.406: ASP.7 32.18,13.28 32.18,23.6 31.54,24.23 31.54,25.5 v30.59,26.45
GND  (via drill 0.3, 3.1)  (1 unrouted)
  Top 0.406: IC2.6 36.29,23.6 | 36.29,23.6 36.3,23.6 v36.62,23.28 | IC2.28 44.09,23.6 | 44.09,23.6 44.08,23.6 v43.76,23.91 | IC2.39 39.95,30.26 40.78,31.09 | 40.78,31.09 40.91,31.22 v41.22,31.22 | 44.09,23.6 43.9,23.98 v43.76,23.91 | 44.09,23.6 43.7,23.78 v43.76,23.91 | 36.29,23.6 36.48,23.21 v36.62,23.28 | 36.29,23.6 36.68,23.42 v36.62,23.28 | v41.22,31.22 41.28,31.36 | v41.22,31.22 41.28,31.07 | 40.78,31.09 41.21,31.06 v41.22,31.22 | 40.78,31.09 41.14,31.34 v41.22,31.22 | 41.28,31.36 | v41.22,31.22 41.28,31.36 | v41.22,31.22 41.28,31.07 | v41.22,31.22 41.28,31.36 | v41.22,31.22 41.28,31.07
  other vias: 36.14,37.73 31.22,42.33 43.61,37.73 38.68,37.73 41.22,37.73 42.49,46.93 40.91,46.93 8.2,46.77 5.35,21.06 5.35,20.1 24.71,29.31 23.44,29.31 25.98,29.31 27.57,21.37 37.41,26.14 42.81,27.88 47.57,21.06 47.57,19.79 47.57,18.52 45.67,13.75 45.67,12.48 45.67,11.21 42.49,1.37 48.53,6.13 5.19,25.82 5.19,24.71 11.38,46.77 9.79,46.77 8.2,45.19 9.79,45.19 11.38,45.19 31.86,42.96 16.3,36.93 17.89,33.6 1.54,37.25 1.54,45.19 1.54,43.92 18.36,45.19 18.36,43.92 39.32,46.93 37.73,46.93 36.14,46.93 34.56,46.93 15.82,12.48 48.53,1.37 26.62,1.37 25.67,1.37 24.71,1.37 24.71,2.64 25.67,2.64 26.62,2.64 28.52,5.82 31.06,5.82 31.06,3.44 33.6,3.44 11.7,1.37 10.74,1.37 9.79,1.37 9.79,2.64 10.74,2.64 11.7,2.64 12.65,2.64 12.65,1.37 19.32,1.37 18.36,1.37 17.41,1.37 17.41,2.64 18.36,2.64 19.32,2.64 20.27,2.64 20.27,1.37 14.55,12.48 26.14,36.77 24.08,38.52 24.71,39.15 31.38,31.22 29.48,33.12 30.43,32.17 38.37,26.14 38.37,27.09 37.41,27.09 35.67,23.28 43.61,21.69 42.81,24.87 43.61,20.74 42.81,23.91 43.76,24.87 44.24,19.47 43.45,19.47 45.03,17.88 27.57,10.9 26.62,12.17 26.62,10.9 26.62,13.12 9.79,39.15 9.79,40.74 11.38,40.74 11.38,39.15 8.2,39.15 8.2,40.74 1.54,36.3 2.49,37.25 4.39,39.15 5.03,39.79 5.66,40.42 14.24,40.11 14.87,39.47 15.51,38.84 17.89,9.79 17.09,9.79 27.57,20.26 27.57,19.15 47.73,39.79 2.81,2.8 5.19,15.34 6.14,15.34 2.49,17.09 2.49,20.9 2.49,19.95 2.49,18.99 2.49,18.04 16.3,37.73 16.3,36.14 18.36,46.46 18.36,47.73 42.49,48.2 40.91,48.2 39.32,48.2 37.73,48.2 36.14,48.2 34.56,48.2 6.3,21.06 6.3,20.1 38.05,14.23 38.05,16.45 37.1,19.15 39,19.63 43.45,6.61 24.87,19.95 43.76,25.82 38.84,22.33 18.52,34.23 7.25,32.33 8.05,32.33 22.02,27.25 23.29,27.25 24.56,27.25 19.79,23.91 24.08,20.58 17.73,21.22 20.75,19.79 20.75,18.99 21.54,18.99 21.54,19.79 22.33,18.99 24.08,21.37 24.08,22.17 24.87,20.74 24.08,19.79 21.54,32.96 24.08,25.18 26.78,25.98 27.73,25.98 16.94,12.48 3.76,5.66 4.71,5.66 1.66,12.3 1.66,11.35 1.66,10.39 1.66,9.44 1.66,8.49 17.89,8.99 14.87,18.83 13.13,15.98 13.92,15.98 18.05,15.98 18.84,15.98 27.41,23.76 28.21,23.76 28.21,16.77 27.41,16.77 34.87,31.06 35.83,32.8 28.05,48.2 28.05,47.41 28.05,46.62 24.56,35.03 21.7,38.04 28.37,38.84 29.64,38.84 30.91,38.84 32.18,38.84 22.17,41.38 22.17,46.46 7.25,21.06 8.2,21.06 9.16,21.06 10.11,21.06 7.25,20.1 5.35,19.15 6.3,19.15 5.35,18.2 18.36,20.58 18.76,23.15
  pour Bottom (isolate 0.305, rank 6): 0.17,49.59 50.28,49.58 50.28,0.06 0.17,0.05
  pour Top (isolate 0.305, rank 6): 0.17,49.59 50.28,49.58 50.28,0.06 0.17,0.05
LEDA
  Top 0.305: 28J60.27 18.11,19.57 16.3,21.37 14.08,21.37 12.65,22.8 4.87,22.8 3.81,23.86 R13.2
LEDB
  Top 0.305: 28J60.26 17.46,19.26 15.98,20.74 13.76,20.74 12.33,22.17 4.39,22.17 1.9,24.66 R14.2
N$1
  Top 0.406: Q1.2 29.29,22.79 C13.2 | IC2.7 29.31,22.8 Q1.2 | 29.34,21.55 29.27,21.62 Q1.2
  Top 0.508: Y2.1 29.34,21.55
N$3
  Top 0.508: R8.2 45.89,32.79 IR.3
N$5
  Top 0.61: R1.1 6.71,1.91 LED4.A
N$7
  Top 0.406: R2.2 22.17,43.92 20.94,45.16 NRF.3
N$9
  Top 0.305: C5.2 6,30.69 R11.1 9.15,30.69 R12.2
N$11
  Top 0.406: C7.A 21.92,24.85 28J60.1
N$13
  Top 0.305: 28J60.14 10.29,24.87
  Top 0.406: 10.29,24.87 R15.2
N$14
  Top 0.406: C14.2 26.12,17.94 Q1.1 | Q1.1 33.33,22 IC2.8 | Y2.3 Q1.1
N$15
  Top 0.356: R9.1 15.2,28.99 | C4.2
  Top 0.406: 13.41,28.98 R10.2 13.22,28.99
  Top 0.61: 13.41,28.98 R9.1 | X1.4 12.55,31.69 12.55,29.66 13.22,28.99 | 15.2,28.99 C4.2 | C4.2 L1.1
N$16
  Top 0.406: 28J60.24 16.16,16.23 18.1,14.29 Q2.2 | Q2.2 18.21,11.18 C17.2 | Y1.1 16.99,14.29 Q2.2
N$17
  Top 0.406: 28J60.23 15.51,16.3 13.5,14.29 Q2.1 | Q2.1 13.38,11.15 C18.2 | Y1.3 14.57,14.29 Q2.1
N$23
  Top 0.406: R13.1 3.81,35.71 6.14,38.04 11.86,38.04 12.81,39 12.81,43.93 X1.9
N$24
  Top 0.406: X1.12 7.01,43.75 7.01,40.15 1.9,35.04 R14.1
N$29
  Top 0.406: R6.2 31.06,34.29 LCD.2
RESET  (via drill 0.5)
  Top 0.356: 28J60.10 12.91,23.65 14.4,22.17 19.63,22.17 20.59,23.12 23.6,23.12 25.35,24.87 v32.65,24.87
  Top 0.406: IC2.4 32.98,25.2 v32.65,24.87 | R4.1 33.6,14.15 ASP.5
  Bottom 0.406: S1.2 49.64,13.29 49.64,4.86 48.21,3.44 36.78,3.44 36.14,4.07 36.14,5.98 34.87,7.25 34.87,10.9 ASP.5 33.13,12.64 33.13,24.39 v32.65,24.87
TPIN+  (via drill 0.5)
  Top 0.356: 28J60.13 10.96,26.08 v10.43,26.61 9.95,27.09 8.84,27.09 7.6,28.33 R11.2
  Bottom 0.356: v10.43,26.61 10.43,31.53 11.73,32.84 X1.3
TPIN-
  Top 0.356: 28J60.12 11.61,28.04 10.86,28.79 | R12.1 10.68,28.97 10.86,28.79 | X1.6 10.86,30.84 10.86,28.79
TPOUT+  (via drill 0.5)
  Top 0.356: X1.1 15.19,35.4 R9.2 | 28J60.17 11.61,19.86 v12.49,20.74
  Bottom 0.356: v12.49,20.74 14.27,22.52 X1.1
TPOUT-  (via drill 0.5)
  Top 0.356: X1.2 13.72,33.06 R10.1 | 28J60.16 10.96,20.8 v11.38,21.22
  Bottom 0.356: v11.38,21.22 13,22.83 X1.2
VDD
  Top 0.406: R5.2 41.86,6.89
  Top 0.508: R17.1 39.43,4.72 | R16.1 39.41,2.18 | 41.86,3.44 45.3,3.44 U$5.1 48.36,2.17 C11.2 | 41.86,3.44 37.43,3.44 | 41.86,6.89 42.49,6.26 42.49,4.23 41.86,3.59 41.86,3.44
  Top 0.813: 39.43,4.72 SV1.8 37.43,3.44 SV1.7 39.41,2.18
VIN
  Bottom 0.508: IC1.3 17.28,7.54 13.68,11.14
  Bottom 0.61: X1.7 5.37,36.32 2.54,33.49 2.54,23.86 4.08,22.33 4.08,14.72 7.66,11.14 13.68,11.14
VUSB
  Top 0.406: USB1.P1 5.3,11.74 6.87,10.17 BXS1.2

### Text on the board
tPlace: Via PKJ | TX | RX | GND | VDD | GND | SCL | SDA | VDD | 5v | 3v3 | dht | dht | dht
bPlace: VIA PKJ 2013.07